# EAGLE design light_detector (EAGLE 7.7.0)
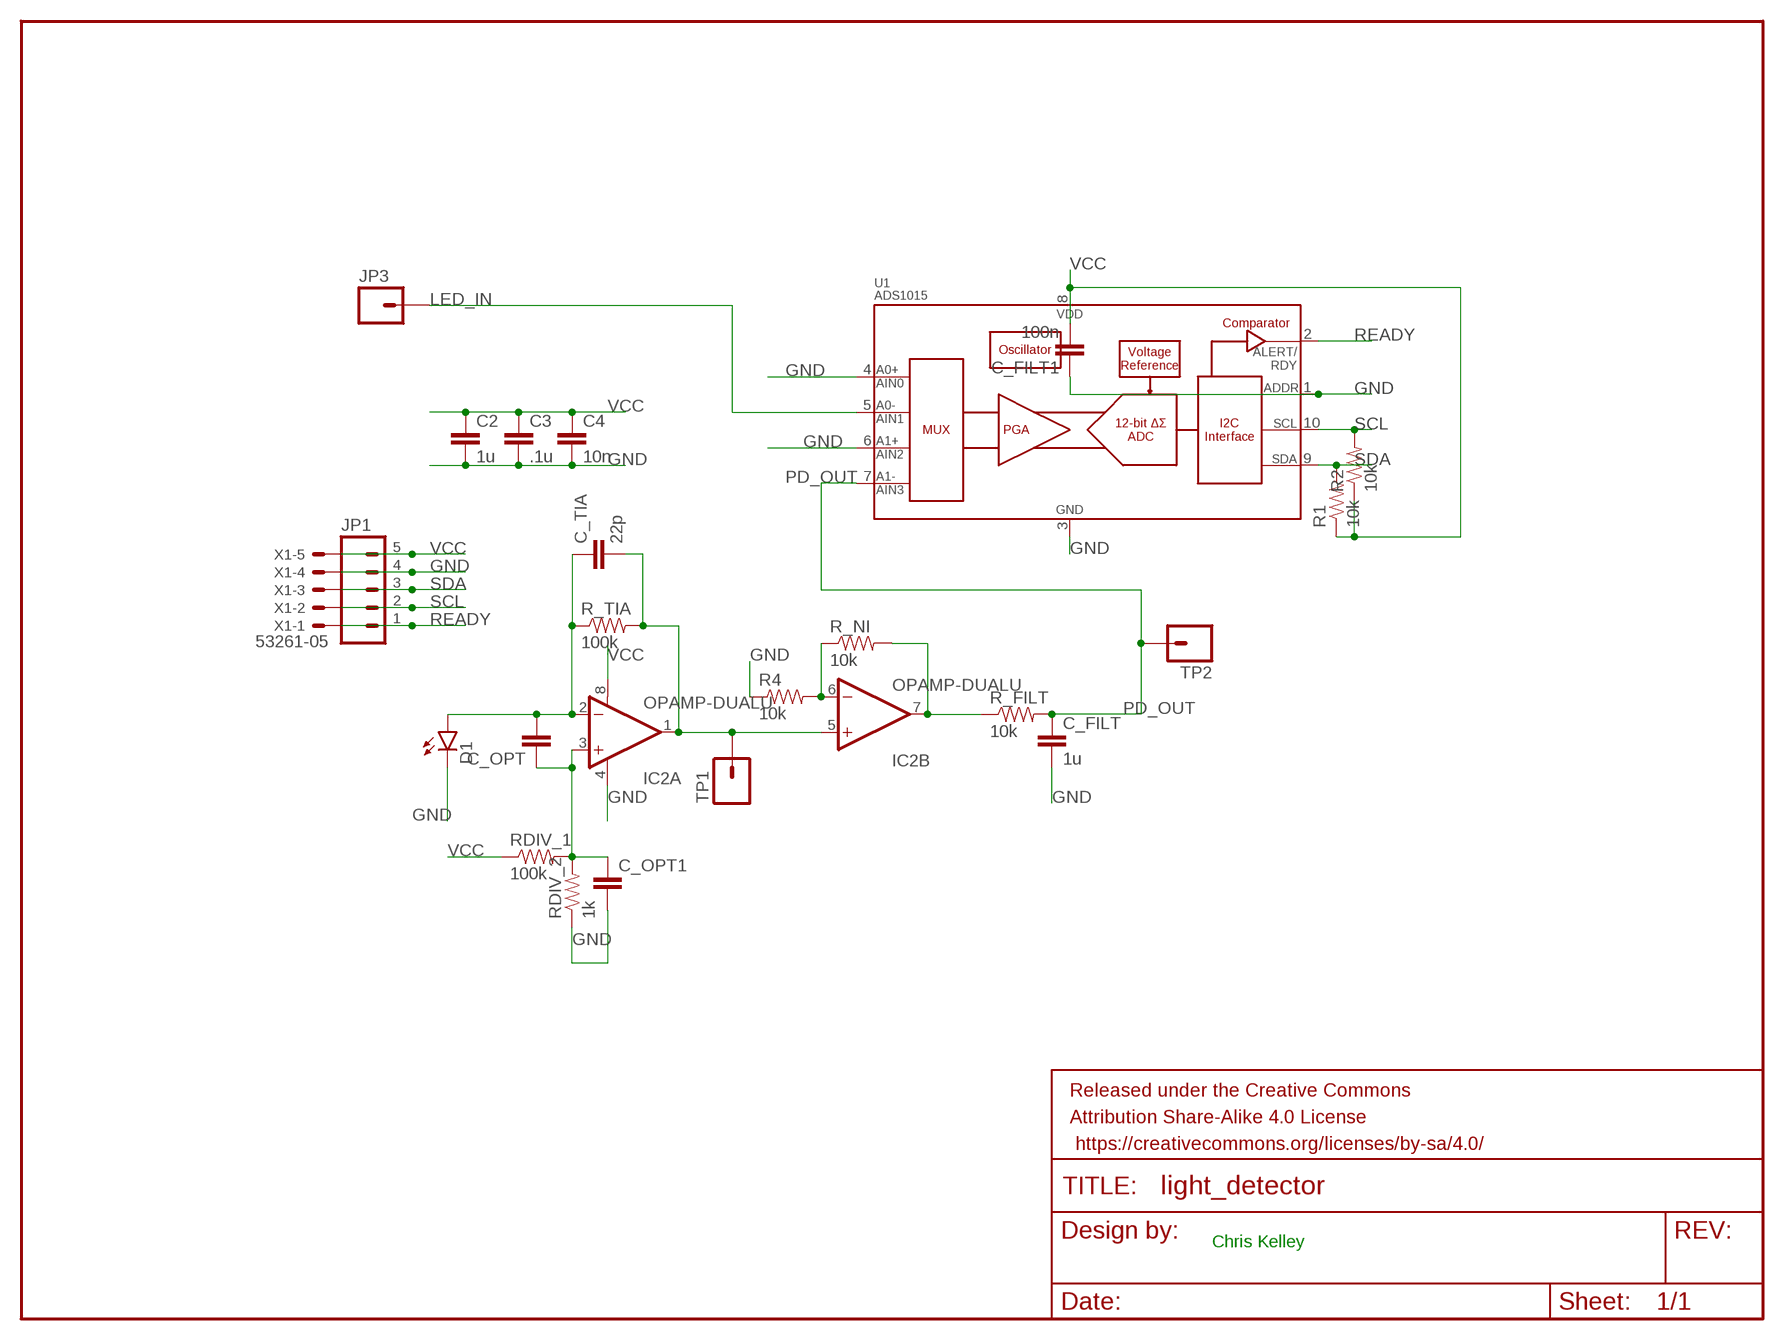
[diagram p0: schematic, sheet 1]

## Parts
C2  1u  CAP0805  [0805]
C3  .1u  CAP0805  [0805]
C4  10n  CAP0805  [0805]
C_FILT  1u  CAP0805  [0805]
C_FILT1  100n  CAP0805  [0805]
C_OPT  CAP0805  [0805]
C_OPT1  CAP0805  [0805]
C_TIA  22p  CAP0805  [0805]
D1  LED5MM  [LED5MM]
FRAME1  FRAME-LETTER  [CREATIVE_COMMONS]
IC2  OPAMP-DUALU  [SO08]
JP1  M05PTH  [1X05]
JP3  M01PTH  [1X01]
R1  10k  RESISTOR0603-RES  [0603-RES]
R2  10k  RESISTOR0603-RES  [0603-RES]
R4  10k  RESISTOR0603-RES  [0603-RES]
R_FILT  10k  RESISTOR0603-RES  [0603-RES]
R_NI  10k  RESISTOR0603-RES  [0603-RES]
R_TIA  100k  RESISTOR0603-RES  [0603-RES]
RDIV_1  100k  RESISTOR0603-RES  [0603-RES]
RDIV_2  1k  RESISTOR0603-RES  [0603-RES]
TP1  M01PTH  [1X01]
TP2  M01PTH  [1X01]
U1  ADS1015  [MSOP10]
X1  53261-05  [53261-05]

## Nets
GND: C2.2 C3.2 C4.2 C_FILT1.1 C_FILT.2 C_OPT1.2 D1.K(C) IC2.4(A:V-) JP1.4 R4.1 RDIV_2.1 U1.1(ADDR) U1.3(VSS) U1.4(AIN0) U1.6(AIN2) X1.4
LED_IN: JP3.1 U1.5(AIN1)
N$1: C_OPT.2 C_TIA.1 D1.A IC2.2(A:-IN) R_TIA.1
N$2: C_TIA.2 IC2.1(A:OUT) IC2.5(B:+IN) R_TIA.2 TP1.1
N$3: C_OPT1.1 C_OPT.1 IC2.3(A:+IN) RDIV_1.2 RDIV_2.2
N$4: IC2.7(B:OUT) R_FILT.1 R_NI.2
N$5: IC2.6(B:-IN) R4.2 R_NI.1
PD_OUT: C_FILT.1 R_FILT.2 TP2.1 U1.7(AIN3)
READY: JP1.1 U1.2(ALERT/RDY) X1.1
SCL: JP1.2 R2.2 U1.10(SCL) X1.2
SDA: JP1.3 R1.2 U1.9(SDA) X1.3
VCC: C2.1 C3.1 C4.1 C_FILT1.2 IC2.8(A:V+) JP1.5 R1.1 R2.1 RDIV_1.1 U1.8(VDD) X1.5

## Notes on the sheet
- Chris Kelley

## Library data of the parts
C2-C4 C_FILT C_FILT1 C_OPT C_OPT1 C_TIA = SparkFun-Passives:CAP: Capacitor Standard 0603 ceramic capacitor, and 0.1" leaded capacitor.
D1 = SparkFun-LED:LED: LEDs Standard schematic elements and footprints for 5mm, 3mm, 1206, and 0603 sized LEDs. 5mm - Spark Fun Electronics SKU : COM-00529 (and others)
FRAME1 = SparkFun-Aesthetics:FRAME-LETTER: Schematic Frame Standard 8.5x11 US Letter frame
IC2 = SparkFun-AnalogIC:OPAMP-DUAL: Generic op-amp footprint
JP1 = SparkFun-Connectors:M05: Header 5 Standard 5-pin 0.1" header. Use with straight break away headers (SKU : PRT-00116), right angle break away headers (PRT-00553), swiss pins (PRT-00743), machine pins (PRT-00117), and female headers (PRT-00115). Molex polarized connector foot print use with SKU : PRT-08230 with associated crimp pins and housings.
JP3 TP1 TP2 = SparkFun-Connectors:M01: Header 1 Standard 1-pin 0.1" header. Use with straight break away headers (SKU : PRT-00116), right angle break away headers (PRT-00553), swiss pins (PRT-00743), machine pins (PRT-00117), and female headers (PRT-00115).
R1 R2 R4 R_FILT R_NI R_TIA RDIV_1 RDIV_2 = SparkFun-Passives:RESISTOR: Resistor Basic schematic elements and footprints for 0603, 1206, and PTH resistors.
U1 = SparkFun-AnalogIC:ADS1015: 12-Bit Del-Sig ADC Four single-ended inputs or two differential inputs Internal PGA I2C interface 2.0-5.5V; PROD_ID: IC-12239
X1 = con-molex:53?-05: CONNECTOR wire to board 1.25 mm (.049 inch) pitch header; OC_FARNELL: 1433644; OC_NEWARK: unknown

## Board
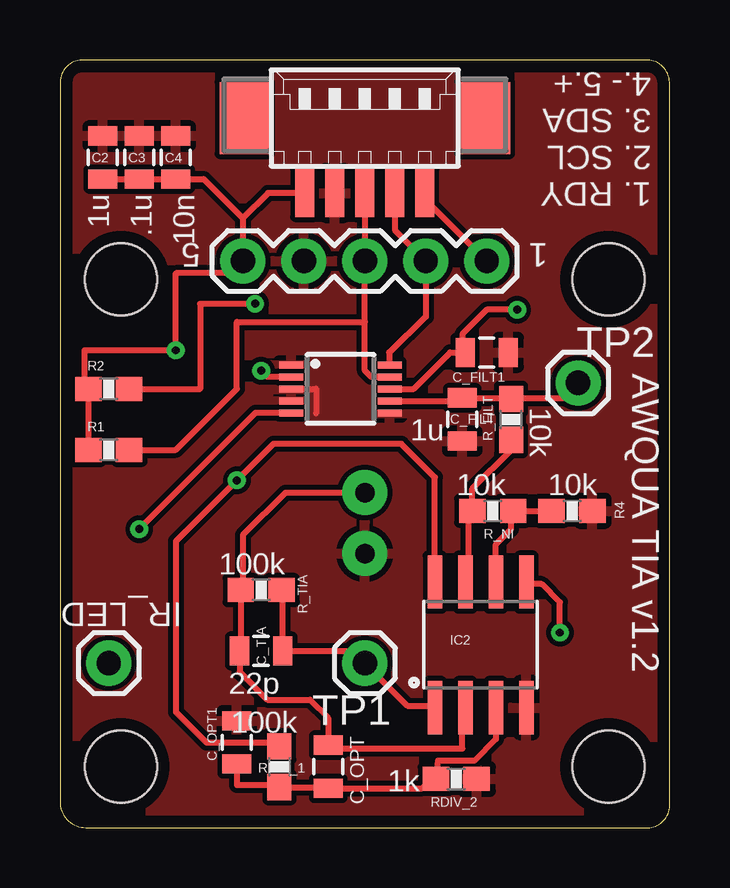
[diagram p1: board, top side]
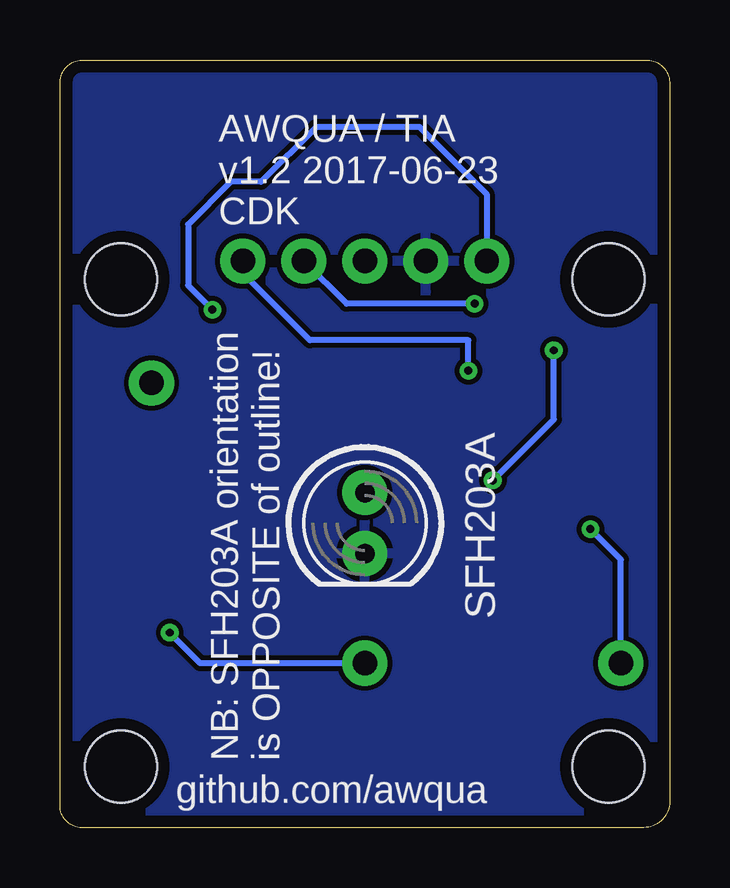
[diagram p2: board, bottom side, seen from below]

Size 25.4 x 32 mm. Coordinates in mm from the lower left corner, seen from the top.
Outline: 1.08,0 24.48,0 arc90 25.4,0.92 25.4,30.99 arc90 24.48,32 0.92,32 arc90 0,30.99 0,1.08 arc90 1.08,0
Copper layers (1*16): Top 0.035mm / dielectric 1.5mm / Bottom 0.035mm
Design rules "default *": minimum track width 8mil, minimum drill 12mil, track to track 8mil, track to pad 8mil, pad to pad 8mil, via to via 8mil, smd to smd 8mil, copper to edge 20mil, drill to drill 8mil, minimum pad ring 10mil, minimum via ring 8mil, stop-mask expansion 2mil, vias tented up to drill 13mil, thermal gap 10mil
Holes 3 mm at 22.86,2.54 22.86,22.86 2.54,22.86 2.54,2.54

### Footprints (pad centres in the part's own frame; a part is rotated, then mirrored left to right if it is on the bottom)
0805 = smd 0.8 x 1.2: 1 -0.9,0; 2 0.9,0
LED5MM = drill 0.813 pad 1.88: A -1.27,0; K 1.27,0
SO08 = smd 0.61 x 2.21: 1 -1.905,-2.616; 2 -0.635,-2.616; 3 0.635,-2.616; 4 1.905,-2.616; 5 1.905,2.616; 6 0.635,2.616; 7 -0.635,2.616; 8 -1.905,2.616
1X05 = drill 1.016 pad 1.88: 1 0,0; 2 2.54,0; 3 5.08,0; 4 7.62,0; 5 10.16,0
1X01 = drill 1.016 pad 1.88: 1 0,0
0603-RES = smd 1.1 x 1: 1 -0.85,0; 2 0.85,0
MSOP10 = smd 0.3 x 1: 1 -1,-2.05; 2 -0.5,-2.05; 3 0,-2.05; 4 0.5,-2.05; 5 1,-2.05; 6 1,2.05; 7 0.5,2.05; 8 0,2.05; 9 -0.5,2.05; 10 -1,2.05
53261-05 = smd 0.8 x 2: 1 2.5,-2.5; 2 1.25,-2.5; 3 0,-2.5; 4 -1.25,-2.5; 5 -2.5,-2.5 | smd 2.1 x 3: S1 5,0.625; S2 -5,0.625

### Placement (x,y rotation side)
C2  1.78,27.94 90 top
C3  3.3,27.94 90 top
C4  4.83,27.94 90 top
C_FILT  16.76,17.02 270 top
C_FILT1  17.78,19.81 180 top
C_OPT  11.18,2.54 90 top
C_OPT1  7.37,3.56 90 top
C_TIA  8.38,7.37 0 top
D1  12.7,12.7 270 bottom
FRAME1  16.51,-15.24 0 top  (outside the outline)
IC2  17.53,7.62 0 top
JP1  17.78,23.62 180 top
JP3  2.03,6.86 0 top
R1  2.03,15.75 0 top
R2  2.03,18.29 0 top
R4  21.34,13.21 180 top
R_FILT  18.8,17.02 90 top
R_NI  18.03,13.21 180 top
R_TIA  8.38,9.91 0 top
RDIV_1  9.14,2.54 270 top
RDIV_2  16.51,2.03 180 top
TP1  12.7,6.86 0 top
TP2  21.59,18.54 0 top
U1  11.68,18.29 270 top
X1  12.7,28.96 0 top

### Tracks (layer width: path | path; a pad name or v marks a point on that pad's centre or on a via)
GND
  Top 0.254: U1.3 10.67,18.29 10.67,17.27
  pour Bottom: -5.33,42.16 32.77,43.43 32.26,-2.03 -5.84,-3.3
  pour Top: -4.06,40.89 34.04,42.16 33.53,-3.3 -4.57,-4.57
LED_IN  (via drill 0.33)
  Top 0.254: U1.5 8.14,17.29 v3.3,12.45
  Bottom 0.254: JP3.1 2.03,11.18 v3.3,12.45
N$1
  Top 0.254: IC2.2 16.76,4.88 16.76,3.3 11.68,3.3 11.29,3.44 C_OPT.2 11.18,4.57 10.41,5.33 8.64,5.33 7.48,6.49 C_TIA.1 7.53,7.42 R_TIA.1 7.62,9.99 7.62,12.19 9.4,13.97 D1.A
N$2  (via drill 0.33)
  Top 0.254: v20.83,8.13 20.83,9.4 20.07,10.16 19.51,10.16 IC2.5 | R_TIA.2 9.28,9.86 C_TIA.2 12.19,7.37 TP1.1 14.48,5.08 15.55,5.08 IC2.1
  Bottom 0.254: TP1.1 19.56,6.86 v20.83,8.13
N$3
  Top 0.254: IC2.3 18.16,3.68 17.27,2.79 15.75,2.79 RDIV_2.2 15.49,2.03 15.1,1.64 C_OPT.1 11.13,1.69 RDIV_1.2 9.06,1.78 7.37,1.78 C_OPT1.1
N$4
  Top 0.254: IC2.7 17.02,10.36 17.02,13.21 17.18,13.37 R_NI.2 17.18,14.14 18.8,15.75 R_FILT.1
N$5
  Top 0.254: R4.2 R_NI.1 18.8,13.37 18.8,12.45 18.16,11.81 IC2.6
PD_OUT
  Top 0.254: U1.7 16.39,17.79 C_FILT.1 18.82,17.92 | 18.82,17.92 R_FILT.2 | 18.82,17.92 20.97,17.92 TP2.1
READY  (via drill 0.33)
  Top 0.254: X1.1 15.2,26.2 JP1.1 | U1.2 8.64,18.79 v8.38,19.05
  Bottom 0.254: v8.38,19.05 8.38,20.32 14.99,20.32 17.78,23.11 JP1.1
SCL  (via drill 0.33)
  Top 0.254: X1.2 13.95,24.91 JP1.2 15.24,21.3 13.72,19.81 13.72,19.29 U1.10 | R2.2 5.84,18.29 5.84,21.84 v8.13,21.84
  Bottom 0.254: v8.13,21.84 13.46,21.84 JP1.2
SDA
  Top 0.254: X1.3 JP1.3 12.7,21.08 | U1.9 12.96,18.79 12.7,19.05 12.7,21.08 | R1.2 4.83,15.75 7.37,18.29 7.37,21.08 12.7,21.08
VCC  (via drill 0.33)
  Top 0.254: C2.1 C3.1 C4.1 5.98,27.04 7.62,25.4 | 10.16,26.42 X1.5 8.68,26.46 7.62,25.4 | IC2.8 15.62,14.61 14.22,16 8.89,16 v7.37,14.48 4.83,11.94 4.83,4.83 6.1,3.56 8.98,3.56 RDIV_1.1 | U1.8 14.73,18.29 16.26,19.81 C_FILT1.2 16.76,20.18 16.76,20.57 17.78,21.59 v19.05,21.59 | 7.62,25.4 JP1.5 7.62,23.11 4.83,23.11 v4.83,19.9 4.83,19.81 4.74,19.9 1.02,19.9 1.02,18.29 R2.1 R1.1
  Bottom 0.254: JP1.5 7.62,26.42 10.41,29.21 14.73,29.21 17.02,26.92 18.29,26.92 20.07,25.15 20.07,22.61 v19.05,21.59 | v7.37,14.48 4.83,17.02 v4.83,19.9

### Text on the board
tPlace: 1. RDY / 2. SCL / 3. SDA / 4.- 5.+ | 5 | 1 | AWQUA TIA v1.2 | IR_LED | Chris Kelley / AWQUA
bPlace: AWQUA / TIA / v1.2 2017-06-23 / CDK | SFH203A | NB: SFH203A orientation / is OPPOSITE of outline! | github.com/awqua